# EAGLE schematic cell-schematic v12 (EAGLE 9.7.0)
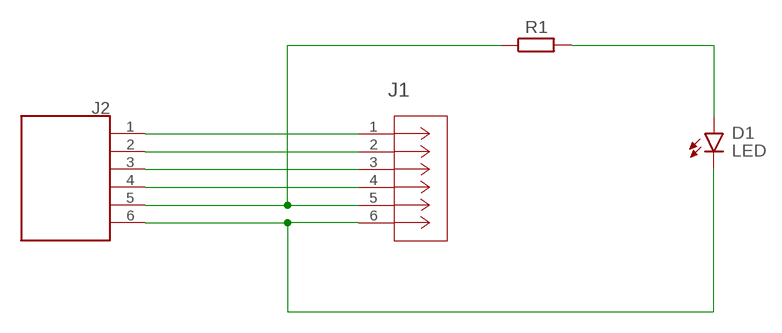
[diagram p0: schematic, sheet 1]

## Parts
D1  LED  CHIP-FLAT-R_1206  [LEDC3216X75N_FLAT-R]
J1  M20-8760342CONN6_M20-8760342_HRW  [CONN6_M20-8760342_HRW]
J2  SAOPADBREAKOUT  [SAOPADBREAKOUT]
R1  R_CHIP-1206(3216-METRIC)  [RESC3216X70]

## Nets
3V3: J1.5 J2.5 R1.1
GND: D1.C J1.6 J2.6
GPIO1: J1.1 J2.1
GPIO2: J1.2 J2.2
NS$1: D1.A R1.2
SCL: J1.4 J2.4
SDA: J1.3 J2.3

## Library data of the parts
D1 = LED:CHIP-FLAT-R; CATEGORY: LED; COLOR: RED; DESCRIPTION: CHIP LED FLAT; SUB-CATEGORY: CHIP; TYPE: FLAT_TOP; VALUE: LED_RED
J1 = Library:M20-8760342; COPYRIGHT: Copyright (C) 2024 Ultra Librarian. All rights reserved.; MANUFACTURER_PART_NUMBER: M20-8760342; MFR_NAME: Harwin
J2 = Library:SAOPADBREAKOUT
R1 = Resistor:R: Resistor Fixed - Generic; CATEGORY: Resistor; SUB-CATEGORY: Fixed